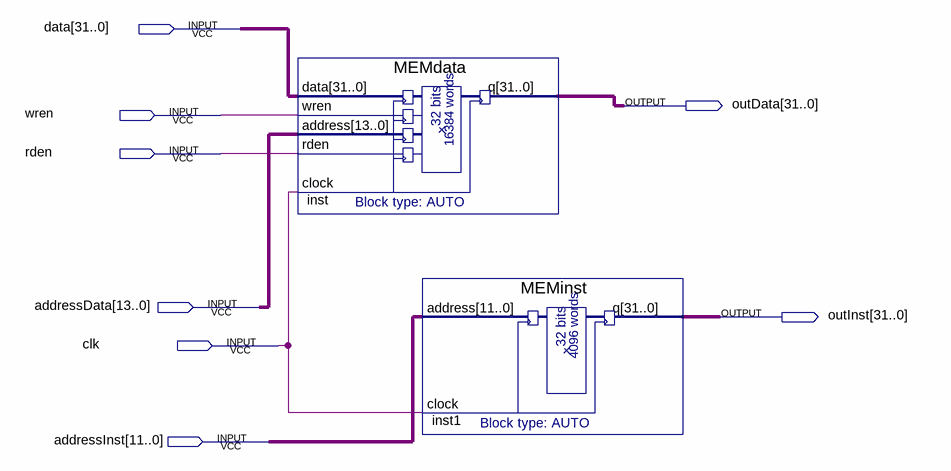
[diagram p0: schematic sheet]
// Quartus schematic TesteMemorias.bdf as structural Verilog: 2 symbols, 8 pins
module TesteMemorias (
  input  [31:0] data,
  input  wren,
  input  rden,
  input  [13:0] addressData,
  input  clk,
  input  [11:0] addressInst,
  output [31:0] outData,
  output [31:0] outInst
);

  MEMdata inst (.data(data), .wren(wren), .address(addressData), .rden(rden), .clock(clk), .q(outData));
  MEMinst inst1 (.address(addressInst), .clock(clk), .q(outInst));
endmodule
